# Altium schematic sheet [08] MISC.SchDoc
size A4
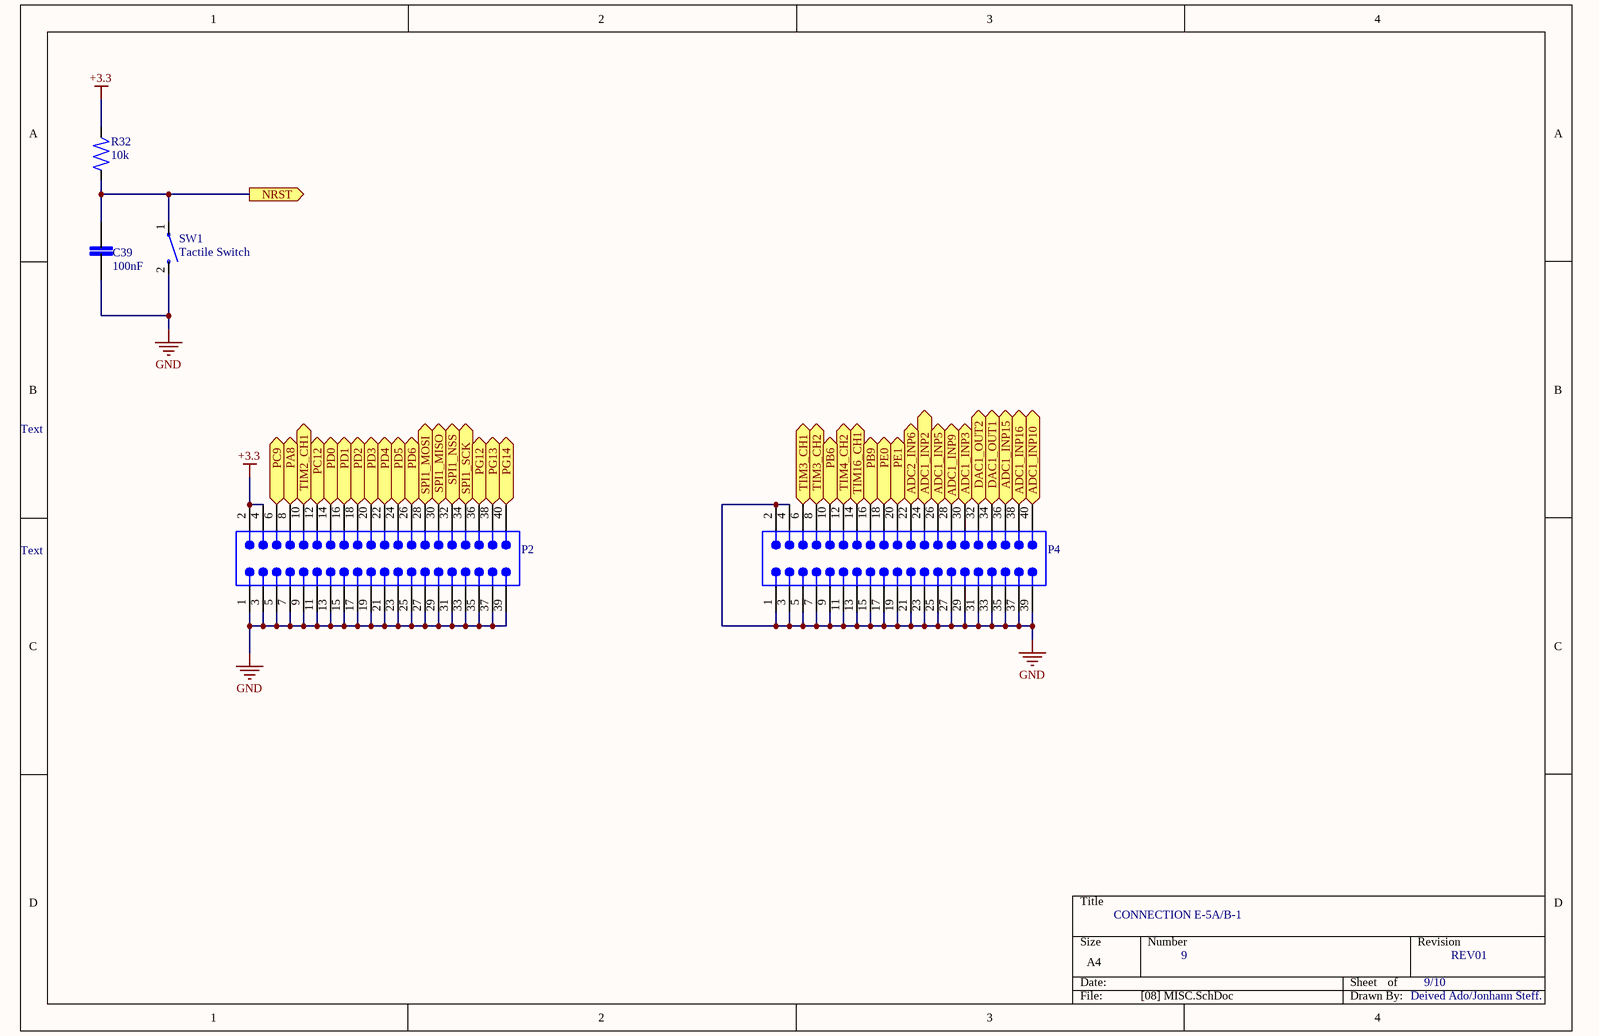
[diagram p0: [08] MISC.SchDoc]

## Parts
C39  100nF  [CAP_0603]
P2  62504021621  [62504021621]  (value not drawn)
P4  62504021621  [62504021621]  (value not drawn)
R32  10k  [RES_0603]
SW1  Tactile Switch  [SW_1437566-3]

## Ports
ADC1_INP2, ADC1_INP3, ADC1_INP5, ADC1_INP9 (out), ADC1_INP10 (out), ADC1_INP15, ADC1_INP16, ADC2_INP6 (out), DAC1_OUT1 (in), DAC1_OUT2 (in), NRST (out), PA8 (bidir), PB6 (bidir), PB9 (bidir), PC9 (bidir), PC12 (bidir), PD0 (bidir), PD1 (bidir), PD2 (bidir), PD3 (bidir), PD4 (bidir), PD5 (bidir), PD6 (bidir), PE0 (bidir), PE1 (bidir), PG12 (bidir), PG13 (bidir), PG14 (bidir), SPI1_MISO (out), SPI1_MOSI (in), SPI1_NSS (in), SPI1_SCK (in), TIM2_CH1 (in), TIM3_CH1 (in), TIM3_CH2 (in), TIM4_CH2 (in), TIM16_CH1 (in)

## Nets
+3.3: P2.2 P2.4 R32.2
GND: C39.1 P2.1 P2.3 P2.5 P2.7 P2.9 P2.11 P2.13 P2.15 P2.17 P2.19 P2.21 P2.23 P2.25 P2.27 P2.29 P2.31 P2.33 P2.35 P2.37 P2.39 P4.1 P4.2 P4.3 P4.4 P4.5 P4.7 P4.9 P4.11 P4.13 P4.15 P4.17 P4.19 P4.21 P4.23 P4.25 P4.27 P4.29 P4.31 P4.33 P4.35 P4.37 P4.39 SW1.2
ADC1_INP2: P4.24 ; port ADC1_INP2
ADC1_INP3: P4.30 ; port ADC1_INP3
ADC1_INP5: P4.26 ; port ADC1_INP5
ADC1_INP9: P4.28 ; port ADC1_INP9
ADC1_INP10: P4.40 ; port ADC1_INP10
ADC1_INP15: P4.36 ; port ADC1_INP15
ADC1_INP16: P4.38 ; port ADC1_INP16
ADC2_INP6: P4.22 ; port ADC2_INP6
DAC1_OUT1: P4.34 ; port DAC1_OUT1
DAC1_OUT2: P4.32 ; port DAC1_OUT2
NRST: C39.2 R32.1 SW1.1 ; port NRST
PA8: P2.8 ; port PA8
PB6: P4.10 ; port PB6
PB9: P4.16 ; port PB9
PC9: P2.6 ; port PC9
PC12: P2.12 ; port PC12
PD0: P2.14 ; port PD0
PD1: P2.16 ; port PD1
PD2: P2.18 ; port PD2
PD3: P2.20 ; port PD3
PD4: P2.22 ; port PD4
PD5: P2.24 ; port PD5
PD6: P2.26 ; port PD6
PE0: P4.18 ; port PE0
PE1: P4.20 ; port PE1
PG12: P2.36 ; port PG12
PG13: P2.38 ; port PG13
PG14: P2.40 ; port PG14
SPI1_MISO: P2.30 ; port SPI1_MISO
SPI1_MOSI: P2.28 ; port SPI1_MOSI
SPI1_NSS: P2.32 ; port SPI1_NSS
SPI1_SCK: P2.34 ; port SPI1_SCK
TIM2_CH1: P2.10 ; port TIM2_CH1
TIM3_CH1: P4.6 ; port TIM3_CH1
TIM3_CH2: P4.8 ; port TIM3_CH2
TIM4_CH2: P4.12 ; port TIM4_CH2
TIM16_CH1: P4.14 ; port TIM16_CH1

## Notes on the sheet
- Text
- CONNECTION E-5A/B-1
- 9
- 9/10
- REV01
- Deived Ado/Jonhann Steff.

## Library data of the parts
C39 = C_Small: Generic capacitor symbol
P2 P4 = 62504021621: WR-BHD Male Box Header, THT Straight, pitch 2mm, 2 row, 40 pin; Manufacturer: Wurth Elektronik; Contact Resistance: 20mOhm; Insulation Resistance: 1000MOhm; Rated Current: 2A; Working Voltage: 250V; Withstanding Voltage: 500V; Manufacturer Part Number: 62504021621; Category: Wire-to-Board Connectors; Match Code: WR-BHD; ComponentLink1Description: Website Link; ComponentLink1URL: https://www.we-online.com/redexpert/article/62504021621?ad; ComponentLink2Description: Datasheet Link; ComponentLink2URL: https://www.we-online.com/redexpert/spec/62504021621?ad; Mount: Through Hole; Operating Temperature Max: 125°C; Operating Temperature Min: -40°C; Packaging: Tray; Length: 47.2mm; Width: 5.5mm; Height: 5.6mm; Gender: Male; Number of Pins: 40; Number of Rows: 2; Orientation: Straight; Pitch: 2mm
R32 = R_Small: Generic Resistor symbol
SW1 = Tactile Switch: Switch Tactile OFF (ON) SPST Rectangular Button Gull Wing 0.05A 12VDC SMD Loose Piece; Manufacturer: TE Connectivity / Alcoswitch; Mfr. Part #: FSMSM; Price: 0,33; Purchase-URL: https://br.mouser.com/ProductDetail/TE-Connectivity-Alcoswitch/FSMSM?qs=UhRTNahLC3yPLf3YjzjKAA%3D%3D; Datasheet: https://br.mouser.com/datasheet/2/418/NG_CD_1437566-3_C2_1437566_3_1_c.dwg-116271.pdf